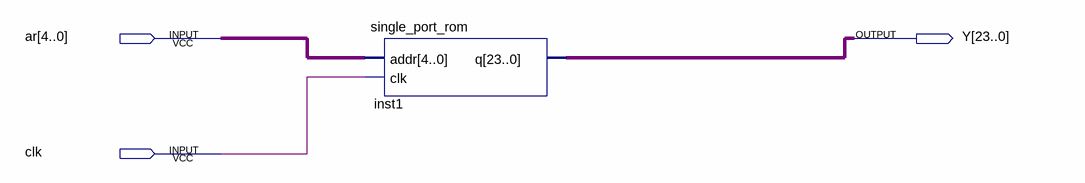
[diagram p0: schematic sheet]
// Quartus schematic test.bdf as structural Verilog: 1 symbols, 3 pins
module test (
  input  [4:0] ar,
  input  clk,
  output [23:0] Y
);

  single_port_rom inst1 (.addr(ar), .clk(clk), .q(Y));
endmodule
